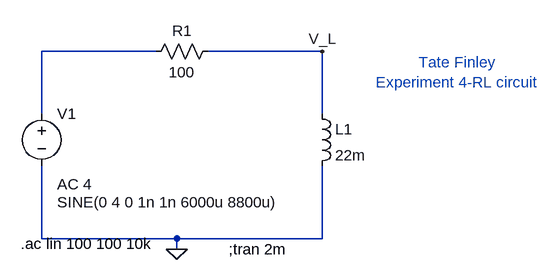
[diagram p0: schematic ECE3060_Exp4_RL.asc]
ECE3060_Exp4_RL.asc, the LTspice schematic file:
Version 4
SHEET 1 880 680
WIRE 96 0 -80 0
WIRE 352 0 176 0
WIRE -80 96 -80 0
WIRE 352 96 352 0
WIRE -80 288 -80 176
WIRE 128 288 -80 288
WIRE 352 288 352 176
WIRE 352 288 128 288
WIRE 128 304 128 288
FLAG 128 304 0
FLAG 352 0 V_L
SYMBOL voltage -80 80 R0
WINDOW 123 24 124 Left 2
WINDOW 39 0 0 Left 0
WINDOW 3 24 152 Left 2
SYMATTR Value2 AC 4
SYMATTR Value SINE(0 4 0 1n 1n 6000u 8800u)
SYMATTR InstName V1
SYMBOL res 192 -16 R90
WINDOW 0 0 56 VBottom 2
WINDOW 3 32 56 VTop 2
SYMATTR InstName R1
SYMATTR Value 100
SYMBOL ind 336 80 R0
SYMATTR InstName L1
SYMATTR Value 22m
TEXT -112 296 Left 2 !.ac lin 100 100 10k
TEXT 560 32 Center 2 ;Tate Finley\nExperiment 4-RL circuit
TEXT 208 304 Left 2 !;tran 2m

The netlist it stands for:
* ECE3060_Exp4_RL.asc
V1 N001 0 SINE(0 4 0 1n 1n 6000u 8800u) AC 4
R1 V_L N001 100
L1 V_L 0 22m
.ac lin 100 100 10k
* Tate Finley
* Experiment 4-RL circuit
;tran 2m
.backanno
.end